# EasyEDA Pro project 按键电灯.eprj

# Schematic Schematic1
Board Name: Board1; Create Date: 2024-08-01; Company: 斯坦纳
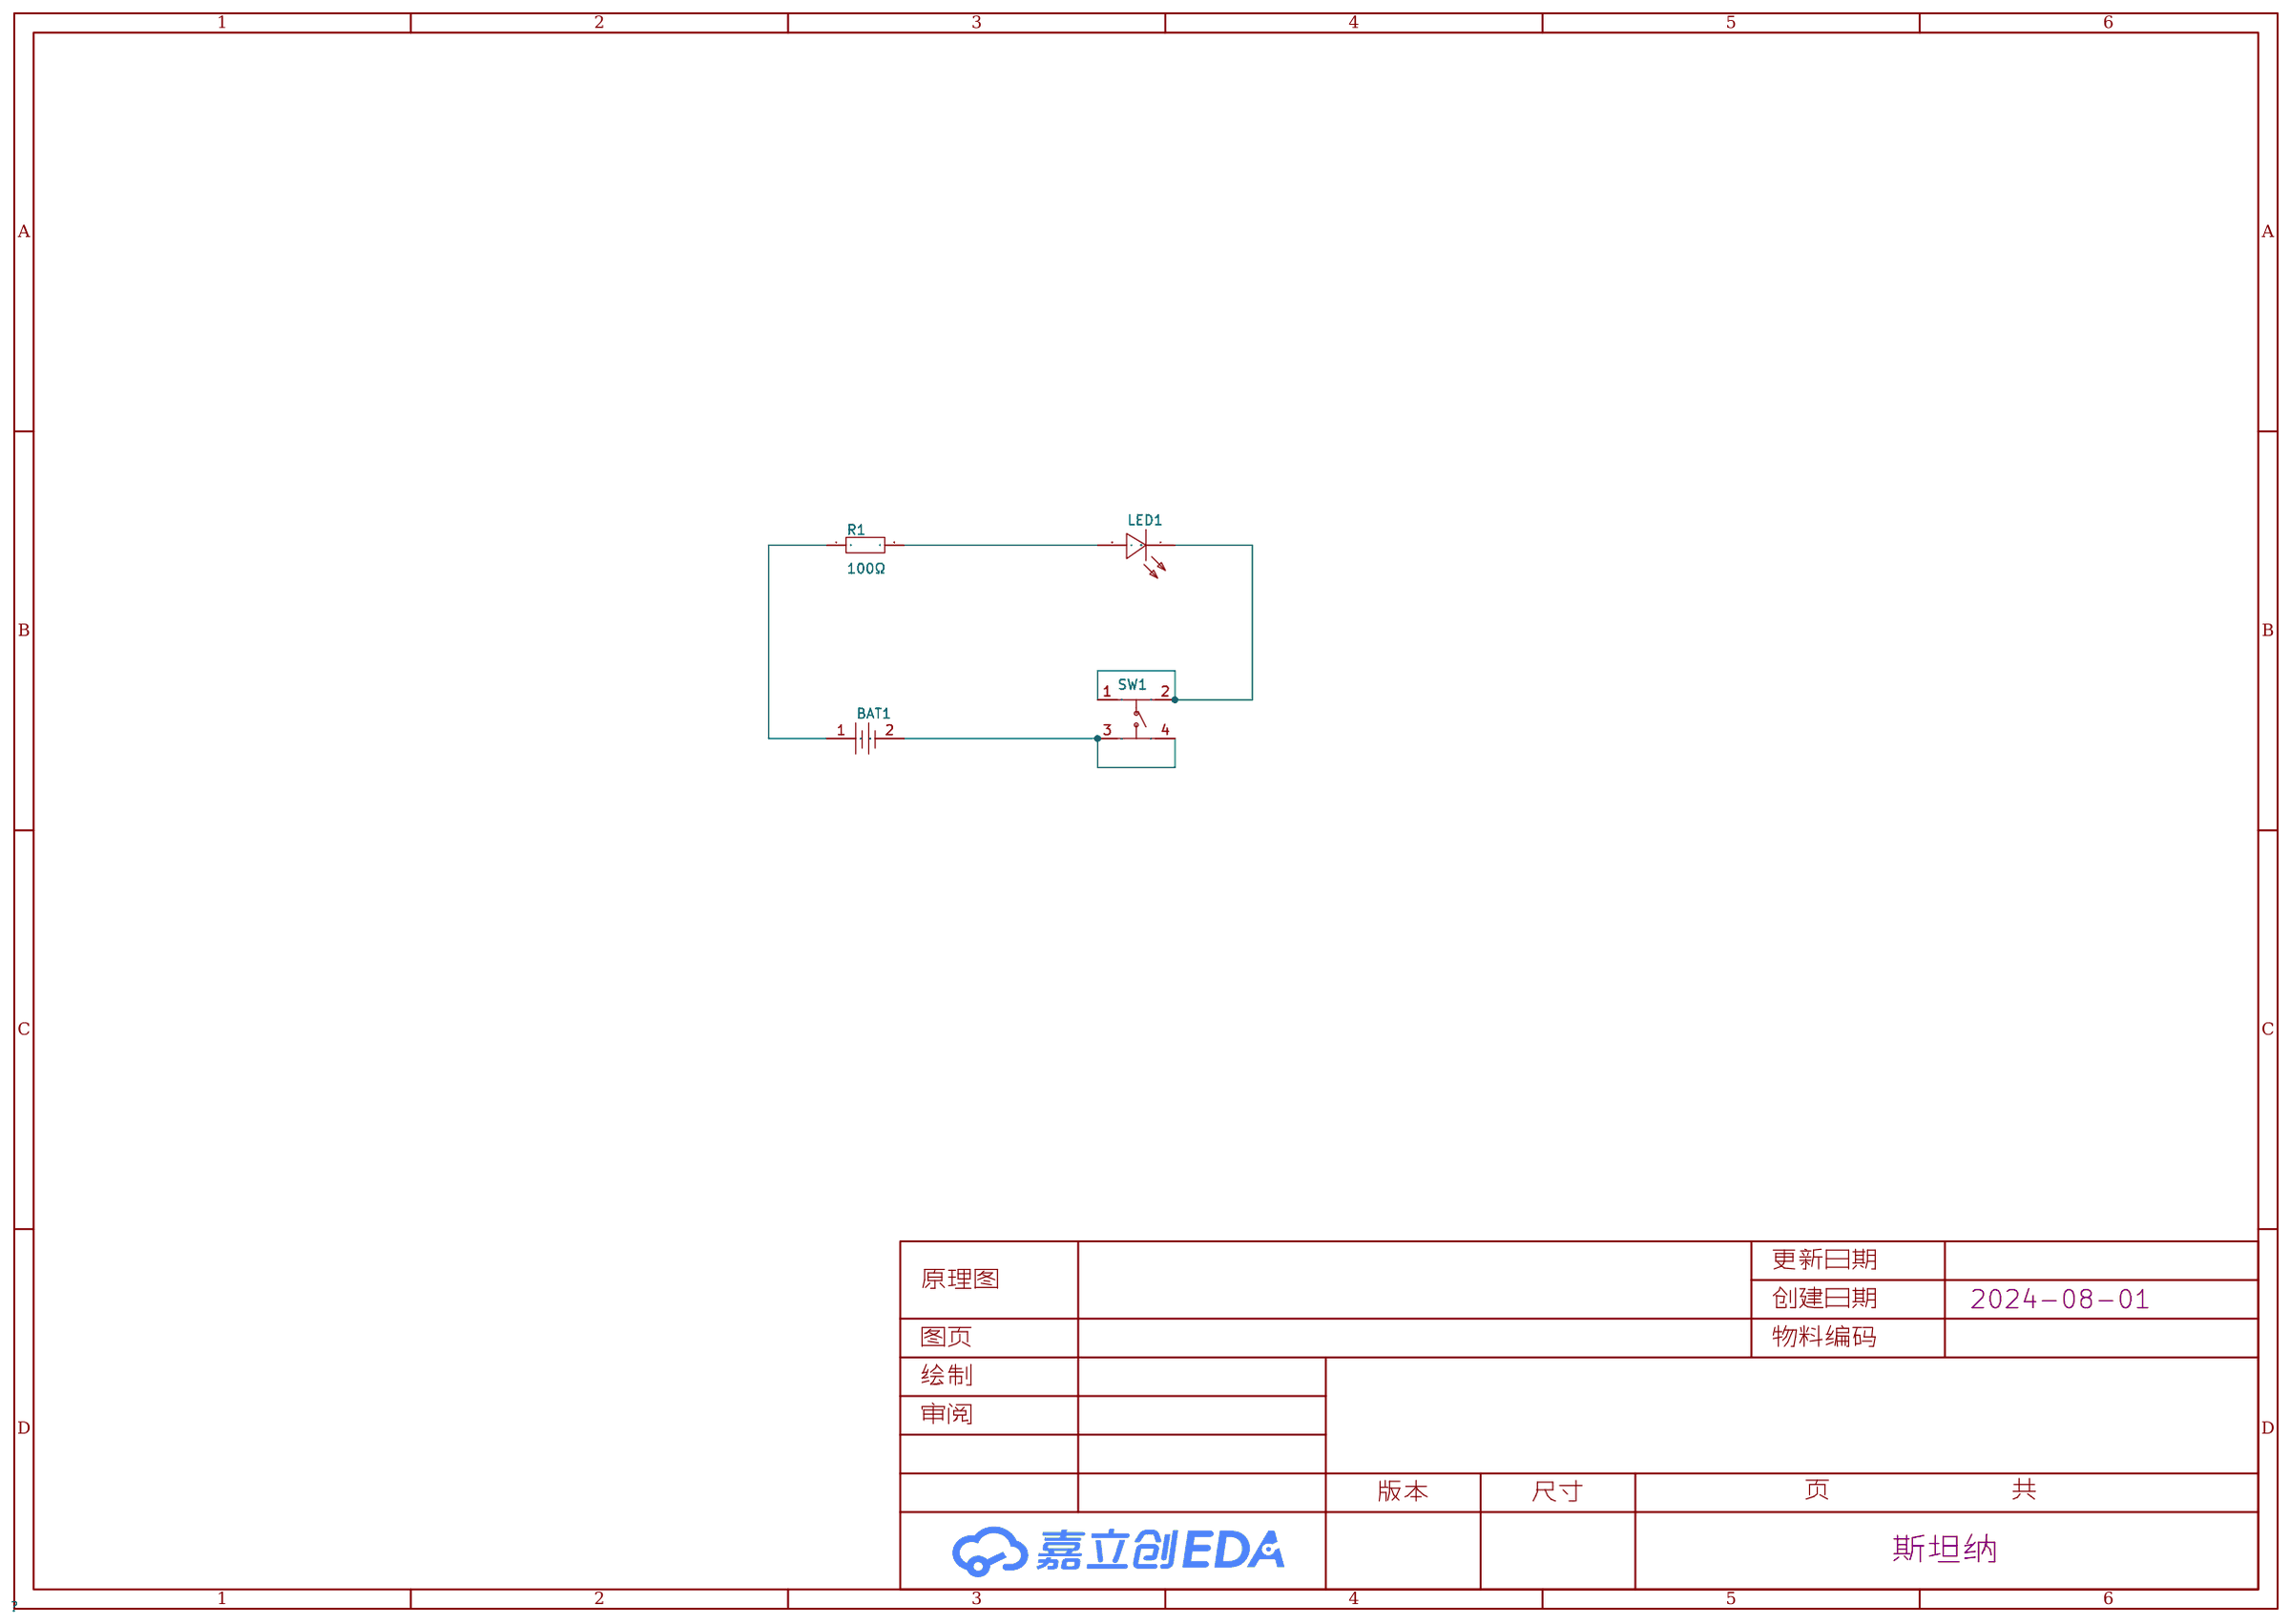
[diagram p0: schematic sheet]

## Parts
BAT1  KH-CR2032-2-1  [BAT-TH_KH-CR2032-2-1]
LED1  204-10SDRD/S530-A3/F182-68  [LED-TH_BD4.0-P2.50-RD]
R1  100Ω  [RES-TH_BD2.2-L6.5-P10.50-D0.6]
SW1  KH-6X6X5H-STM  [SW-SMD_4P-L6.0-W6.0-P4.50-LS9.0-2]

## Library data of the parts
BAT1 = KH-CR2032-2-1: Supplier Part: C5365915; Manufacturer: kinghelm(金航标); JLCPCB Part Class: 扩展库; Datasheet: https://atta.szlcsc.com/upload/public/pdf/source/20230301/F3ED62C53898C1F99BC47B7A2E148BA2.pdf; Supplier: LCSC
LED1 = 204-10SDRD/S530-A3/F182-68: Supplier Part: C473831; Manufacturer: EVERLIGHT(亿光); Supplier Footprint: 插件; JLCPCB Part Class: 扩展库; Supplier: LCSC
R1 = MFR0W4F1000A50: LCSC Part Name: 100Ω ±1% 250mW 金属膜电阻; Supplier Part: C57438; Manufacturer: UNI-ROYAL(厚声); Supplier Footprint: 插件,D2.2xL6.5mm; JLCPCB Part Class: 扩展库; Datasheet: https://atta.szlcsc.com/upload/public/pdf/source/20191012/C436293_8820AA14BC71FA35E551C06C441482A0.pdf; Supplier: LCSC; Type: 金属膜电阻; Tolerance: ±1%; Overload Voltage (Max): 250V; Power(Watts): 250mW; Temperature Coefficient: ±50ppm/℃
SW1 = KH-6X6X5H-STM: LCSC Part Name: 6*6*5mm 立贴 轻触开关; Supplier Part: C2837531; Manufacturer: kinghelm(金航标); Supplier Footprint: SMD; JLCPCB Part Class: 扩展库; Datasheet: https://atta.szlcsc.com/upload/public/pdf/source/20210608/C2837531_45E87AB996CE723B09405FF2EA209C4C.pdf; Supplier: LCSC; Circuit: 单刀单掷; Actuator Style: 圆形按钮; Mounting Style: 立贴; Switch Length: 6mm; Switch Width: 6mm; Switch Height: 5mm; Strike Gundam: 不带; Contact Current: 50mA; Voltage Rating (DC): 12V; Actuator/Cap Color: 黑色; Pin Style: 鸥翼型; Mechanical Life: 8万次

## Nets
$1N252: BAT1.1 R1.1
$1N258: LED1.2(A) R1.2
Net-(BAT1-2): BAT1.2 SW1.3 SW1.4
Net-(LED1-1): LED1.1(C) SW1.1 SW1.2

# Board PCB1
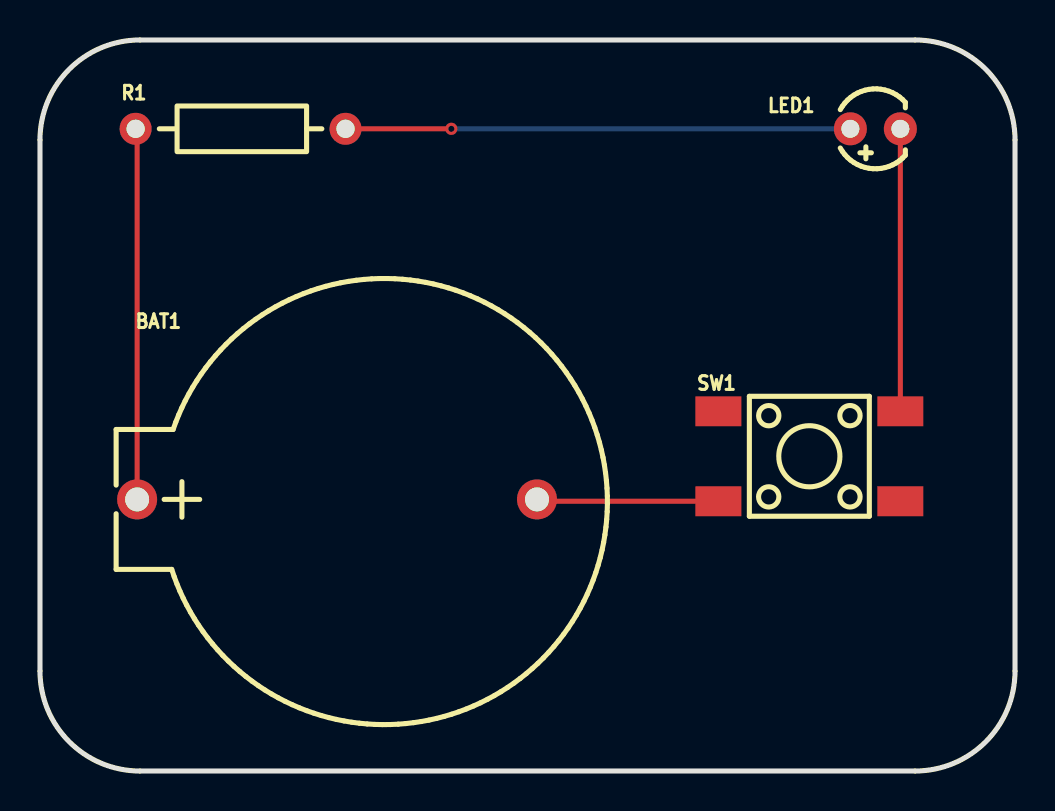
[diagram p1: board, top side]
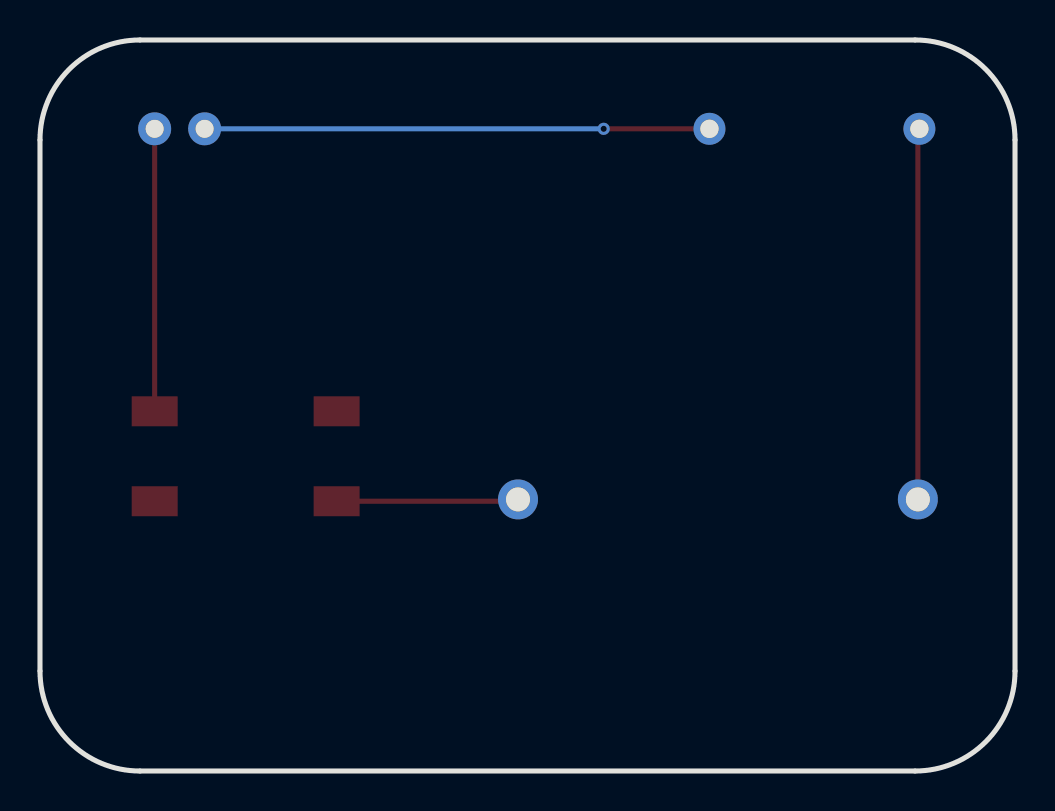
[diagram p2: board, bottom side, seen from below]

Outline 48.77 x 36.58 mm; copper layers: Top Layer, Bottom Layer. Coordinates in mm from the lower left corner of the outline.
Outline path: 0,31.58 0,5 arc(1.46,1.46) 5,0 43.77,0 arc(47.3,1.46) 48.77,5 48.77,31.58 arc(47.3,35.11) 43.77,36.58 5,36.58 arc(1.46,35.11) 0,31.58
Stack: Top Layer 0.035mm / Dielectric1 1.51mm FR4 er 4.5 / Bottom Layer 0.035mm

## Design rules (mm)
template: JLCPCB Capability(Two Layers Board)
spacing copperThickness1oz (default): track to track 0.102, other pairs 0.152 to 0.3
spacing copperThickness2oz: track to track 0.203, other pairs 0.152 to 0.3
track width copperThickness1oz (default): min 0.127, default 0.254, max 2.54
track width copperThickness2oz: min 0.203, default 0.254, max 2.54
differential pair differentialPair (default): width min 0.127, default 0.254, max 2.54; gap min 0.152, default 0.152
via viaSize (default): diameter min 0.5, default 0.61, max 10; hole min 0.3, default 0.305, max 6.3

## Placement (name value [footprint] x y rotation side)
BAT1  KH-CR2032-2-1  [BAT-TH_KH-CR2032-2-1]  14.86 13.59 180 top
LED1  204-10SDRD/S530-A3/F182-68  [LED-TH_BD4.0-P2.50-RD]  41.78 32.13 180 top
R1  100Ω  [RES-TH_BD2.2-L6.5-P10.50-D0.6]  10.03 32.13 0 top
SW1  KH-6X6X5H-STM  [SW-SMD_4P-L6.0-W6.0-P4.50-LS9.0-2]  38.48 15.75 0 top

## Footprints (pads in the part's own frame, mm; a bottom-side part is the same pattern mirrored in y, then rotated)
BAT-TH_KH-CR2032-2-1
  round 2 hole 1.2: 1(10,0) 2(-10,0)
LED-TH_BD4.0-P2.50-RD
  round 1.651 hole 0.9: 1(-1.25,0) 2(1.25,0)
RES-TH_BD2.2-L6.5-P10.50-D0.6
  round 1.6 hole 0.914: 1(-5.25,0) 2(5.25,0)
SW-SMD_4P-L6.0-W6.0-P4.50-LS9.0-2
  rect 2.3x1.5 smd: 1(-4.55,2.25) 2(4.55,2.25) 3(-4.55,-2.25) 4(4.55,-2.25)

## Nets
$1N252: BAT1.1 R1.1
$1N258: LED1.2 R1.2
$1N263: LED1.1 SW1.2
$1N270: BAT1.2 SW1.3

Pads without a net: SW1 1 4

## Via types
v1: diameter 0.61, hole 0.305, Top Layer to Bottom Layer, 1 via

## Routing (per net, layer and track width the routed paths; a pad name or vN(x,y) marks a point on that pad's centre or on a via; arc(x,y) is an arc through that point)
$1N252: length 18.6
  Top Layer w0.254: R1.1 4.86,32.06 BAT1.1
$1N258: length 25.2
  Top Layer w0.254: R1.2 v1(20.57,32.13)
  Bottom Layer w0.254: v1(20.57,32.13) LED1.2
$1N263: length 14.1
  Top Layer w0.254: LED1.1 43.03,18 SW1.2
$1N270: length 9.1
  Top Layer w0.254: SW1.3 24.95,13.5 BAT1.2
